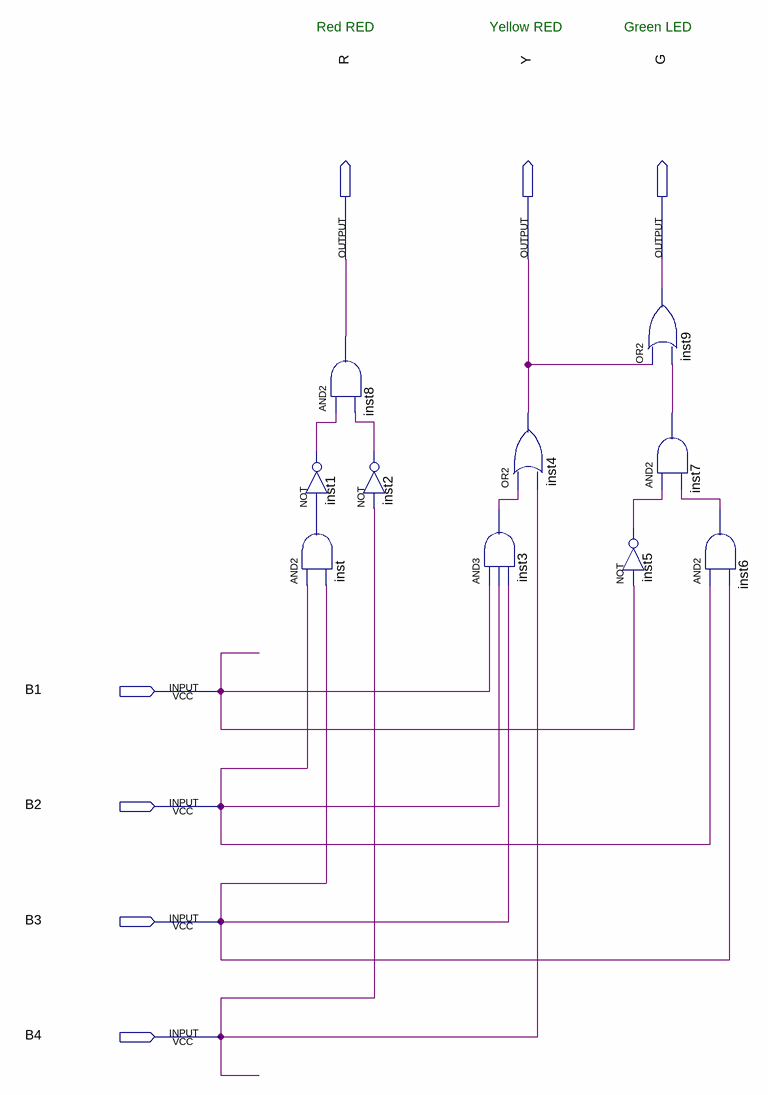
[diagram p0: schematic sheet]
// Quartus schematic Project.bdf as structural Verilog: 10 symbols, 7 pins
module Project (
  input  B1,
  input  B2,
  input  B3,
  input  B4,
  output R,
  output Y,
  output G
);

  wire inst1_out, inst2_out, inst3_out, inst5_out, inst6_out, inst7_out, inst_out;

  and inst (inst_out, B2, B3);
  and inst8 (R, inst1_out, inst2_out);
  not inst1 (inst1_out, inst_out);
  not inst2 (inst2_out, B4);
  or inst4 (Y, inst3_out, B4);
  and inst3 (inst3_out, B1, B2, B3);
  or inst9 (G, Y, inst7_out);
  and inst7 (inst7_out, inst5_out, inst6_out);
  not inst5 (inst5_out, B1);
  and inst6 (inst6_out, B2, B3);

  // Notes on the sheet:
  //   Red RED
  //   Yellow RED
  //   Green LED
endmodule
